# EAGLE schematic 549-capstone (EAGLE 8.1.0)
CDESIGNER: John Bird; CNAME: John Bird

## Sheet 1 of 2
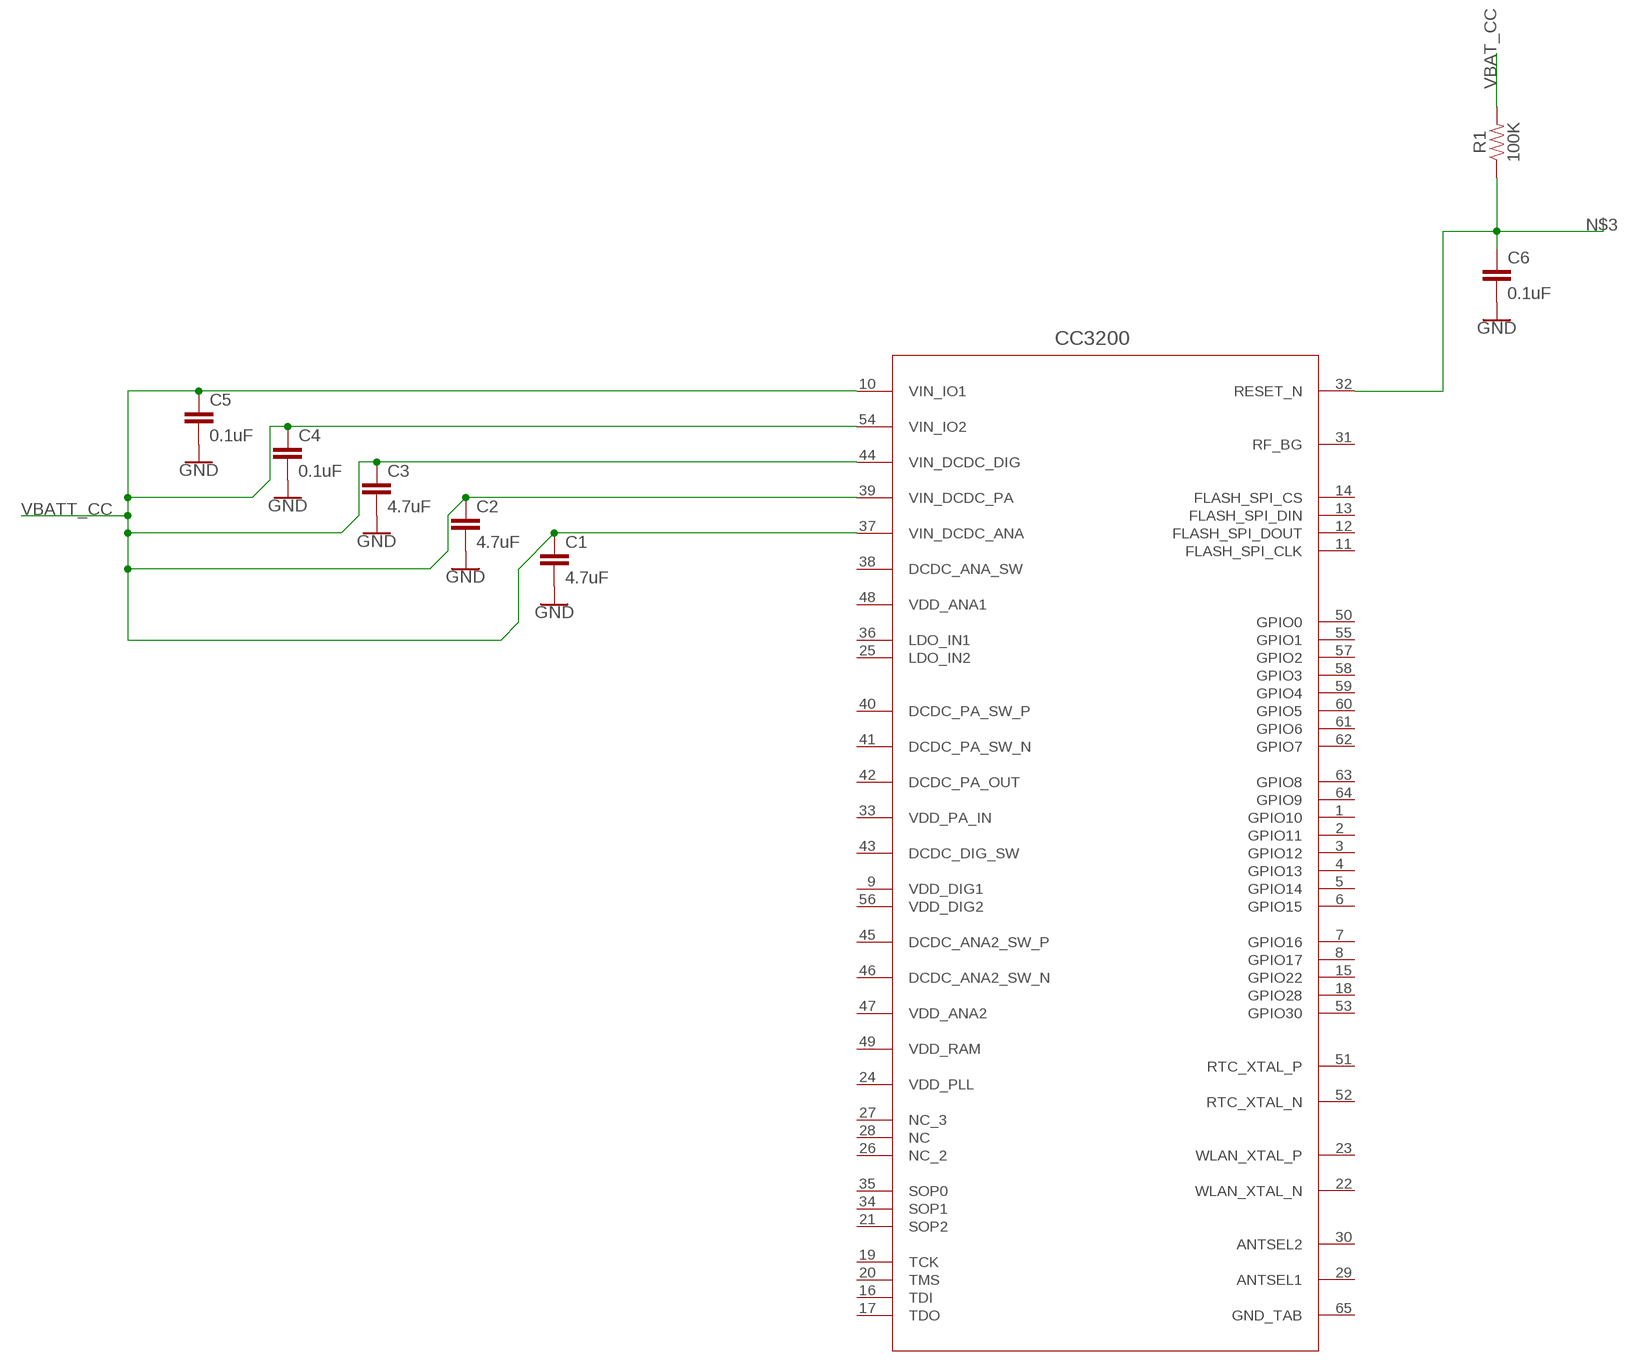
[diagram p0: schematic, sheet 1]

### Parts
C1  4.7uF  4.7UF0603  [0603]
C2  4.7uF  4.7UF0603  [0603]
C3  4.7uF  4.7UF0603  [0603]
C4  0.1uF  0.1UF-0402-16V-10%  [0402]
C5  0.1uF  0.1UF-0402-16V-10%  [0402]
C6  0.1uF  0.1UF-0402-16V-10%  [0402]
CC3200  CC3200R1M2RGCR  [RGC0064A]
R1  100K  100KOHM-0402-1/16W-1%  [0402]

### Nets
GND: C1.2 C2.2 C3.2 C4.2 C5.2 C6.2
N$3: C6.1 CC3200.32(RESET_N) R1.1
VBAT_CC: R1.2
VBATT_CC: C1.1 C2.1 C3.1 C4.1 C5.1 CC3200.10(VIN_IO1) CC3200.37(VIN_DCDC_ANA) CC3200.39(VIN_DCDC_PA) CC3200.44(VIN_DCDC_DIG) CC3200.54(VIN_IO2)
Unconnected: CC3200.1(GPIO10) CC3200.2(GPIO11) CC3200.3(GPIO12) CC3200.4(GPIO13) CC3200.5(GPIO14) CC3200.6(GPIO15) CC3200.7(GPIO16) CC3200.8(GPIO17) CC3200.11(FLASH_SPI_CLK) CC3200.12(FLASH_SPI_DOUT) CC3200.13(FLASH_SPI_DIN) CC3200.14(FLASH_SPI_CS) CC3200.15(GPIO22) CC3200.16(TDI) CC3200.17(TDO) CC3200.18(GPIO28) CC3200.19(TCK) CC3200.20(TMS) CC3200.21(SOP2) CC3200.22(WLAN_XTAL_N) CC3200.23(WLAN_XTAL_P) CC3200.26(NC_2) CC3200.27(NC_3) CC3200.28(NC) CC3200.29(ANTSEL1) CC3200.30(ANTSEL2) CC3200.31(RF_BG) CC3200.34(SOP1) CC3200.35(SOP0) CC3200.45(DCDC_ANA2_SW_P) CC3200.46(DCDC_ANA2_SW_N) CC3200.50(GPIO0) CC3200.51(RTC_XTAL_P) CC3200.52(RTC_XTAL_N) CC3200.53(GPIO30) CC3200.55(GPIO1) CC3200.57(GPIO2) CC3200.58(GPIO3) CC3200.59(GPIO4) CC3200.60(GPIO5) CC3200.61(GPIO6) CC3200.62(GPIO7) CC3200.63(GPIO8) CC3200.64(GPIO9)

## Sheet 2 of 2
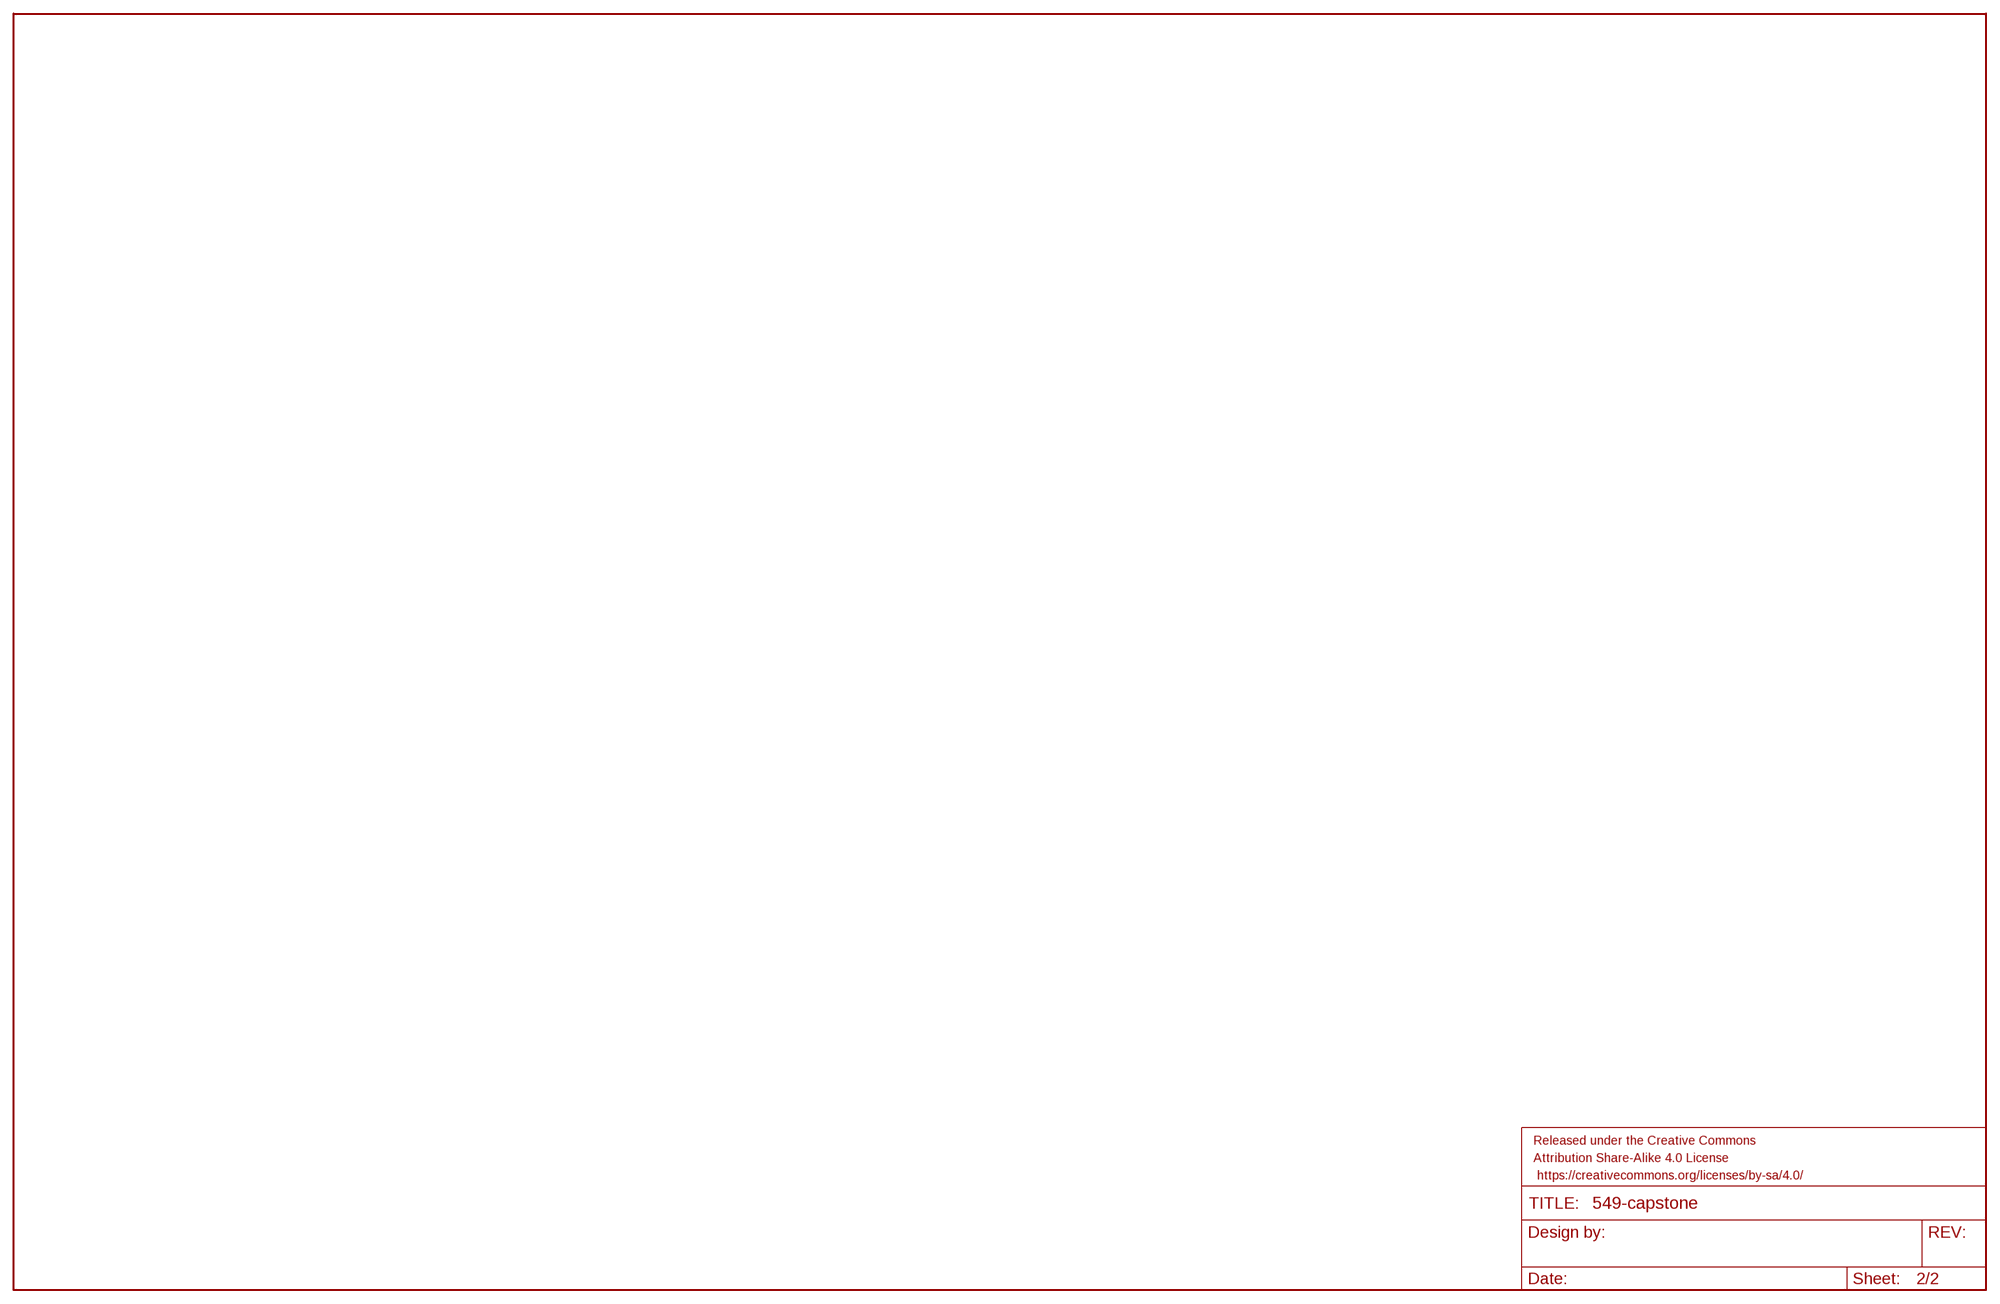
[diagram p1: schematic, sheet 2]

### Parts
FRAME2  FRAME-LEDGER  [CREATIVE_COMMONS]

## Power pins joined to a net without a drawn wire
DCDC_ANA_SW: CC3200.38(DCDC_ANA_SW)
DCDC_DIG_SW: CC3200.43(DCDC_DIG_SW)
DCDC_PA_OUT: CC3200.42(DCDC_PA_OUT)
DCDC_PA_SW_N: CC3200.41(DCDC_PA_SW_N)
DCDC_PA_SW_P: CC3200.40(DCDC_PA_SW_P)
GND_TAB: CC3200.65(GND_TAB)
LDO_IN1: CC3200.36(LDO_IN1)
LDO_IN2: CC3200.25(LDO_IN2)
VDD_ANA1: CC3200.48(VDD_ANA1)
VDD_ANA2: CC3200.47(VDD_ANA2)
VDD_DIG1: CC3200.9(VDD_DIG1)
VDD_DIG2: CC3200.56(VDD_DIG2)
VDD_PA_IN: CC3200.33(VDD_PA_IN)
VDD_PLL: CC3200.24(VDD_PLL)
VDD_RAM: CC3200.49(VDD_RAM)

## Library data of the parts
C1-C3 = SparkFun-Capacitors:4.7UF: 4.7µF ceramic capacitors A capacitor is a passive two-terminal electrical component used to store electrical energy temporarily in an electric field.; PROD_ID: CAP-08280
C4-C6 = SparkFun-Capacitors:0.1UF: 0.1µF ceramic capacitors A capacitor is a passive two-terminal electrical component used to store electrical energy temporarily in an electric field.; PROD_ID: CAP-12416
CC3200 = CC3200:CC3200R1M2RGCR; ALTERNATEPARTNUMBER: CC3200R1M2RGC; COMPTYPE: IC; MANUFACTURER: Texas Instruments; MOUNTTYPE: SMT; PACKAGEREFERENCE: RGC0064A; PARTNUMBER: CC3200R1M2RGCR; PIN_COUNT: 65; REFDES: RefDes; ROHS: Y; TYPE: TYPE; VALUE: Value
FRAME2 = SparkFun-Aesthetics:FRAME-LEDGER: Schematic Frame - Ledger Standard 11x14 US Ledger frame
R1 = SparkFun-Resistors:100KOHM: 100kΩ resistor A resistor is a passive two-terminal electrical component that implements electrical resistance as a circuit element. Resistors act to reduce current flow, and, at the same time, act to lower voltage levels within circuits. - Wikipedia; PROD_ID: RES-13495